# Altium schematic sheet gydrodrive_uart.SchDoc
size 297 x 209 mm; SheetNumber: 15; SheetTotal: 22
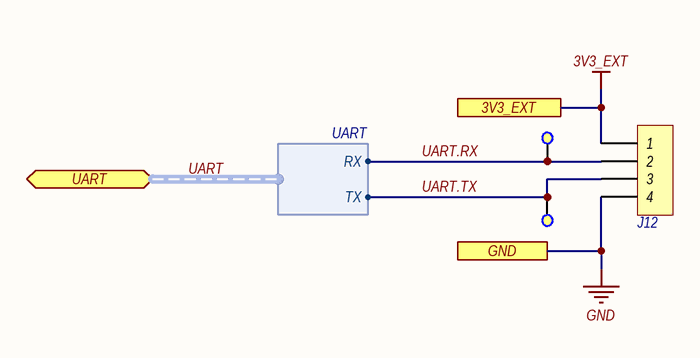
[diagram p0: gydrodrive_uart.SchDoc]

## Parts
J12  DG142V-5.08-04P  [DG142V-5.08-04P]  (value not drawn)
TP12  Test point 1  [TP_1]  (value not drawn)  (no BOM)
TP13  Test point 1  [TP_1]  (value not drawn)  (no BOM)

## Ports
3V3_EXT (see gydrodrive_interfaces[3B], gydrodrive_i2c[5B], gydrodrive_interfaces[3A], gydrodrive_reservedPins[2B], gydrodrive_supply[3B]), GND (see gydrodrive_interfaces[3B], gydrodrive_button[2C], gydrodrive_can[2C], gydrodrive_control[2C], gydrodrive_currentSource[1B], gydrodrive_debugger[3C], gydrodrive_discreteControl[2B], gydrodrive_encoder[1B], gydrodrive_i2c[5C], gydrodrive_indication[3C], gydrodrive_inputTrim[2C], gydrodrive_interfaces[3A], gydrodrive_linearPosSensor[2C], gydrodrive_mcu[6D], gydrodrive_reservedPins[2C], gydrodrive_rs485[2B], gydrodrive_sensor[2C], gydrodrive_sensors[1B], gydrodrive_sto[2C], gydrodrive_supply[2C]), UART (bidir, harness UART, see gydrodrive_interfaces[4B], gydrodrive_mcu[1B])

## Harnesses
UART: RX, TX

## Nets
3V3_EXT: J12.1 ; port 3V3_EXT
GND: J12.4 ; port GND
UART.RX: J12.2 TP12.1 ; port UART.RX
UART.TX: J12.3 TP13.1 ; port UART.TX

## Buses and harness runs
harness UART = port UART

## Notes on the sheet
- Подп. и дата
- Инв. № дубл.
- Взам. инв. №
- Инв. № подл.
- Изм.
- Лист
- № докум.
- Подп.
- Дата
- Копировал
- Формат
- A4

## Library data of the parts
J12 = DG142V-5.08-04P: Клеммник 4-контактный, шаг 5.08 мм; Part Name: Клеммник DG142V-5.08-04P; Parameters: 8А; Max Price: 60; System: Connector; Part Number: DG142V-5.08-04P; Component Type: Standart; Pin Count: 4
TP12 TP13 = Test point 1: Тестовый контакт круглый 1 мм; Part Number: Test point 1; Part Name: Тестовый контакт; Component Type: Standart (No BOM)